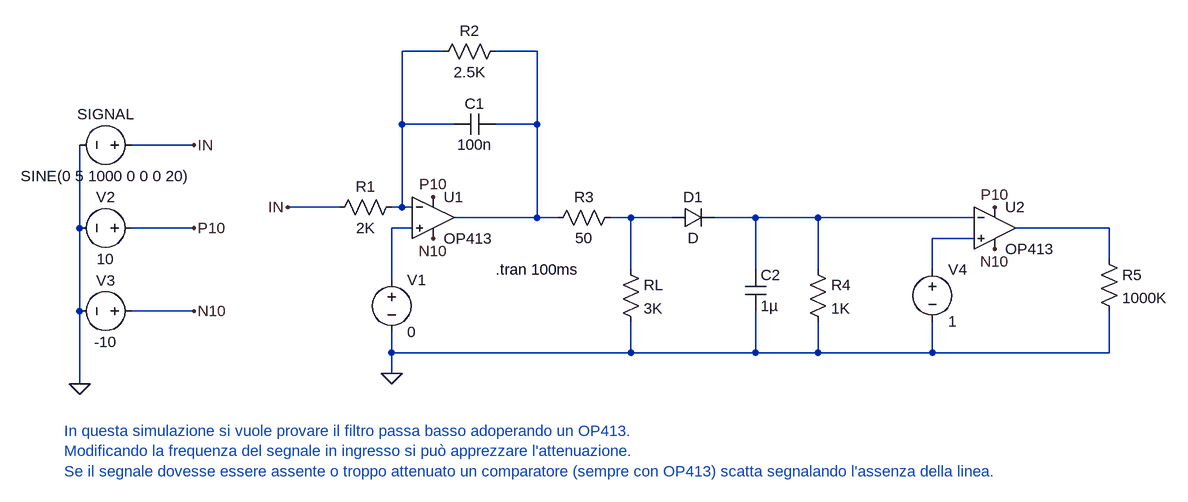
[diagram p0: schematic OP413_LOW-PASS-FILTER_+_COMPARATOR_1V.asc]
OP413_LOW-PASS-FILTER_+_COMPARATOR_1V.asc, the LTspice schematic file:
Version 4
SHEET 1 1312 680
WIRE 192 -272 128 -272
WIRE 336 -272 272 -272
WIRE 128 -160 128 -272
WIRE 208 -160 128 -160
WIRE 336 -160 336 -272
WIRE 336 -160 272 -160
WIRE -192 -128 -288 -128
WIRE 32 -32 -48 -32
WIRE 128 -32 128 -160
WIRE 128 -32 112 -32
WIRE 144 -32 128 -32
WIRE 336 -16 336 -160
WIRE 336 -16 208 -16
WIRE 368 -16 336 -16
WIRE 480 -16 448 -16
WIRE 544 -16 480 -16
WIRE 672 -16 608 -16
WIRE 768 -16 672 -16
WIRE 1008 -16 768 -16
WIRE -368 0 -368 -128
WIRE -192 0 -288 0
WIRE 144 0 112 0
WIRE 1216 0 1072 0
WIRE 1008 16 944 16
WIRE 1216 48 1216 0
WIRE 480 64 480 -16
WIRE 672 64 672 -16
WIRE 768 64 768 -16
WIRE 944 64 944 16
WIRE 112 80 112 0
WIRE -368 128 -368 0
WIRE -192 128 -288 128
WIRE 112 192 112 160
WIRE 480 192 480 144
WIRE 480 192 112 192
WIRE 672 192 672 128
WIRE 672 192 480 192
WIRE 768 192 768 144
WIRE 768 192 672 192
WIRE 944 192 944 144
WIRE 944 192 768 192
WIRE 1216 192 1216 128
WIRE 1216 192 944 192
WIRE 112 224 112 192
WIRE -368 240 -368 128
FLAG -368 240 0
FLAG -192 -128 IN
FLAG -192 0 P10
FLAG -192 128 N10
FLAG 176 16 N10
FLAG 176 -48 P10
FLAG -48 -32 IN
FLAG 112 224 0
FLAG 1040 32 N10
FLAG 1040 -32 P10
SYMBOL OpAmps\\OP413 176 -80 R0
SYMATTR InstName U1
SYMBOL voltage -272 -128 R90
WINDOW 0 -32 56 VBottom 2
WINDOW 3 32 56 VTop 2
WINDOW 123 0 0 Left 0
WINDOW 39 0 0 Left 0
SYMATTR InstName SIGNAL
SYMATTR Value SINE(0 5 1000 0 0 0 20)
SYMBOL voltage -272 0 R90
WINDOW 0 -32 56 VBottom 2
WINDOW 3 32 56 VTop 2
WINDOW 123 0 0 Left 0
WINDOW 39 0 0 Left 0
SYMATTR InstName V2
SYMATTR Value 10
SYMBOL voltage -272 128 R90
WINDOW 0 -32 56 VBottom 2
WINDOW 3 32 56 VTop 2
WINDOW 123 0 0 Left 0
WINDOW 39 0 0 Left 0
SYMATTR InstName V3
SYMATTR Value -10
SYMBOL cap 272 -176 R90
WINDOW 0 0 32 VBottom 2
WINDOW 3 32 32 VTop 2
SYMATTR InstName C1
SYMATTR Value 100n
SYMBOL res 128 -48 R90
WINDOW 0 0 56 VBottom 2
WINDOW 3 32 56 VTop 2
SYMATTR InstName R1
SYMATTR Value 2K
SYMBOL voltage 112 64 R0
WINDOW 123 0 0 Left 0
WINDOW 39 0 0 Left 0
SYMATTR InstName V1
SYMATTR Value 0
SYMBOL res 288 -288 R90
WINDOW 0 0 56 VBottom 2
WINDOW 3 32 56 VTop 2
SYMATTR InstName R2
SYMATTR Value 2.5K
SYMBOL res 464 48 R0
SYMATTR InstName RL
SYMATTR Value 3K
SYMBOL res 464 -32 R90
WINDOW 0 0 56 VBottom 2
WINDOW 3 32 56 VTop 2
SYMATTR InstName R3
SYMATTR Value 50
SYMBOL diode 544 0 R270
WINDOW 0 32 32 VTop 2
WINDOW 3 0 32 VBottom 2
SYMATTR InstName D1
SYMBOL res 752 48 R0
SYMATTR InstName R4
SYMATTR Value 1K
SYMBOL cap 656 64 R0
SYMATTR InstName C2
SYMATTR Value 1µ
SYMBOL OpAmps\\OP413 1040 -64 R0
SYMATTR InstName U2
SYMBOL voltage 944 48 R0
WINDOW 123 0 0 Left 0
WINDOW 39 0 0 Left 0
SYMATTR InstName V4
SYMATTR Value 1
SYMBOL res 1200 32 R0
SYMATTR InstName R5
SYMATTR Value 1000K
TEXT 272 64 Left 2 !.tran 100ms
TEXT -392 312 Left 2 ;In questa simulazione si vuole provare il filtro passa basso adoperando un OP413.\nModificando la frequenza del segnale in ingresso si può apprezzare l'attenuazione.\nSe il segnale dovesse essere assente o troppo attenuato un comparatore (sempre con OP413) scatta segnalando l'assenza della linea.

The netlist it stands for:
* OP413_LOW-PASS-FILTER_+_COMPARATOR_1V.asc
XU1 N005 N001 P10 N10 N002 OP413  ; pins In+ In- V+ V- OUT
V§SIGNAL IN 0 SINE(0 5 1000 0 0 0 20)
V2 P10 0 10
V3 N10 0 -10
C1 N002 N001 100n
R1 N001 IN 2K
V1 N005 0 0
R2 N002 N001 2.5K
RL N003 0 3K
R3 N003 N002 50
D1 N003 N004 D
R4 N004 0 1K
C2 N004 0 1µ
XU2 N007 N004 P10 N10 N006 OP413  ; pins In+ In- V+ V- OUT
V4 N007 0 1
R5 N006 0 1000K
.model D D
.lib standard.dio
.tran 100ms
* In questa simulazione si vuole provare il filtro passa basso adoperando un OP413.
* Modificando la frequenza del segnale in ingresso si può apprezzare l'attenuazione.
* Se il segnale dovesse essere assente o troppo attenuato un comparatore (sempre con OP413) scatta segnalando l'assenza della linea.
.backanno
.end